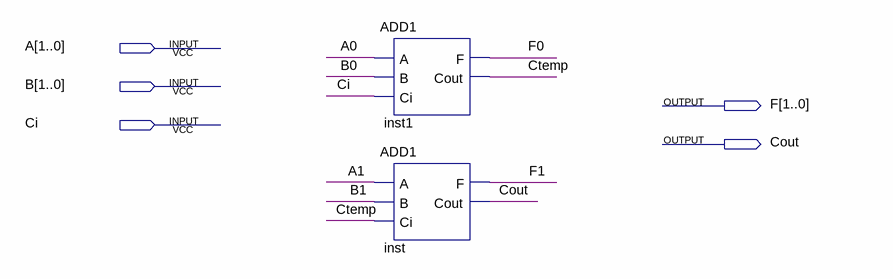
[diagram p0: schematic sheet]
// Quartus schematic ADD2.bdf as structural Verilog: 2 symbols, 5 pins
module ADD2 (
  input  [1:0] A,
  input  [1:0] B,
  input  Ci,
  output [1:0] F,
  output Cout
);

  wire Ctemp;

  ADD1 inst1 (.A(A[0]), .B(B[0]), .Ci(Ci), .F(F[0]), .Cout(Ctemp));
  ADD1 inst (.A(A[1]), .B(B[1]), .Ci(Ctemp), .F(F[1]), .Cout(Cout));
endmodule
